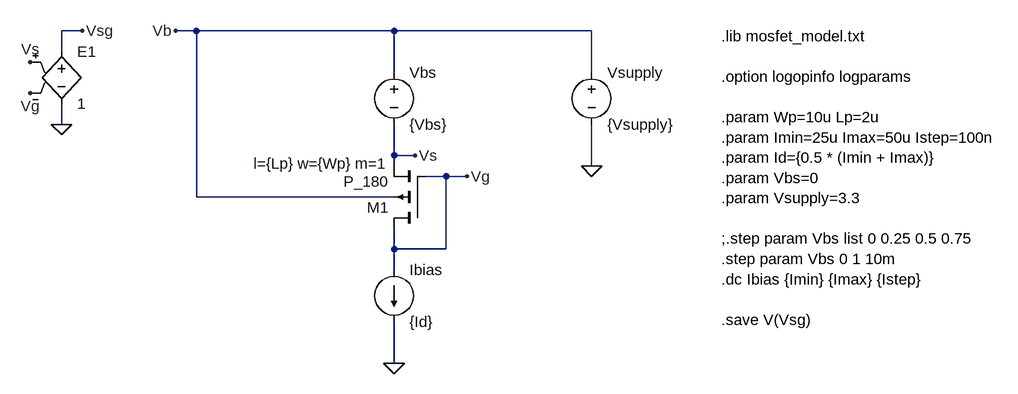
[diagram p0: schematic pmos_single.asc]
pmos_single.asc, the LTspice schematic file:
Version 4.1
SHEET 1 1184 680
WIRE -288 -192 -320 -192
WIRE -112 -192 -144 -192
WIRE 192 -192 -112 -192
WIRE 496 -192 192 -192
WIRE -320 -160 -320 -192
WIRE 192 -128 192 -192
WIRE 496 -128 496 -192
WIRE -320 -48 -320 -80
WIRE 192 0 192 -48
WIRE 224 0 192 0
WIRE 192 16 192 0
WIRE 496 16 496 -48
WIRE 272 32 240 32
WIRE 304 32 272 32
WIRE -112 64 -112 -192
WIRE 192 64 -112 64
WIRE 192 144 192 112
WIRE 272 144 272 32
WIRE 272 144 192 144
WIRE 192 176 192 144
WIRE 192 320 192 256
FLAG 192 320 0
FLAG 496 16 0
FLAG 224 0 Vs
FLAG 304 32 Vg
FLAG -320 -48 0
FLAG -368 -96 Vg
FLAG -368 -144 Vs
FLAG -144 -192 Vb
FLAG -288 -192 Vsg
SYMBOL current 192 176 R0
SYMATTR InstName Ibias
SYMATTR Value {Id}
SYMBOL pmos4 240 112 R180
WINDOW 123 56 100 Left 2
SYMATTR Value2 l={Lp} w={Wp} m=1
SYMATTR InstName M1
SYMATTR Value P_180
SYMBOL voltage 192 -144 R0
SYMATTR InstName Vbs
SYMATTR Value {Vbs}
SYMBOL voltage 496 -144 R0
SYMATTR InstName Vsupply
SYMATTR Value {Vsupply}
SYMBOL e -320 -176 R0
SYMATTR InstName E1
SYMATTR Value 1
TEXT 696 -184 Left 2 !.lib mosfet_model.txt\n \n.option logopinfo logparams\n \n.param Wp=10u Lp=2u\n.param Imin=25u Imax=50u Istep=100n\n.param Id={0.5 * (Imin + Imax)}\n.param Vbs=0\n.param Vsupply=3.3\n \n;.step param Vbs list 0 0.25 0.5 0.75\n.step param Vbs 0 1 10m\n.dc Ibias {Imin} {Imax} {Istep}\n \n.save V(Vsg)

The netlist it stands for:
* pmos_single.asc
Ibias Vg 0 {Id}
M1 Vg Vg Vs Vb P_180 l={Lp} w={Wp} m=1
Vbs Vb Vs {Vbs}
Vsupply Vb 0 {Vsupply}
E1 Vsg 0 Vs Vg 1
.model NMOS NMOS
.model PMOS PMOS
.lib standard.mos
.lib mosfet_model.txt
.option logopinfo logparams
.param Wp=10u Lp=2u
.param Imin=25u Imax=50u Istep=100n
.param Id={0.5 * (Imin + Imax)}
.param Vbs=0
.param Vsupply=3.3
;.step param Vbs list 0 0.25 0.5 0.75
.step param Vbs 0 1 10m
.dc Ibias {Imin} {Imax} {Istep}
.save V(Vsg)
.backanno
.end